# Altium schematic sheet Inputs.SchDoc
size A4
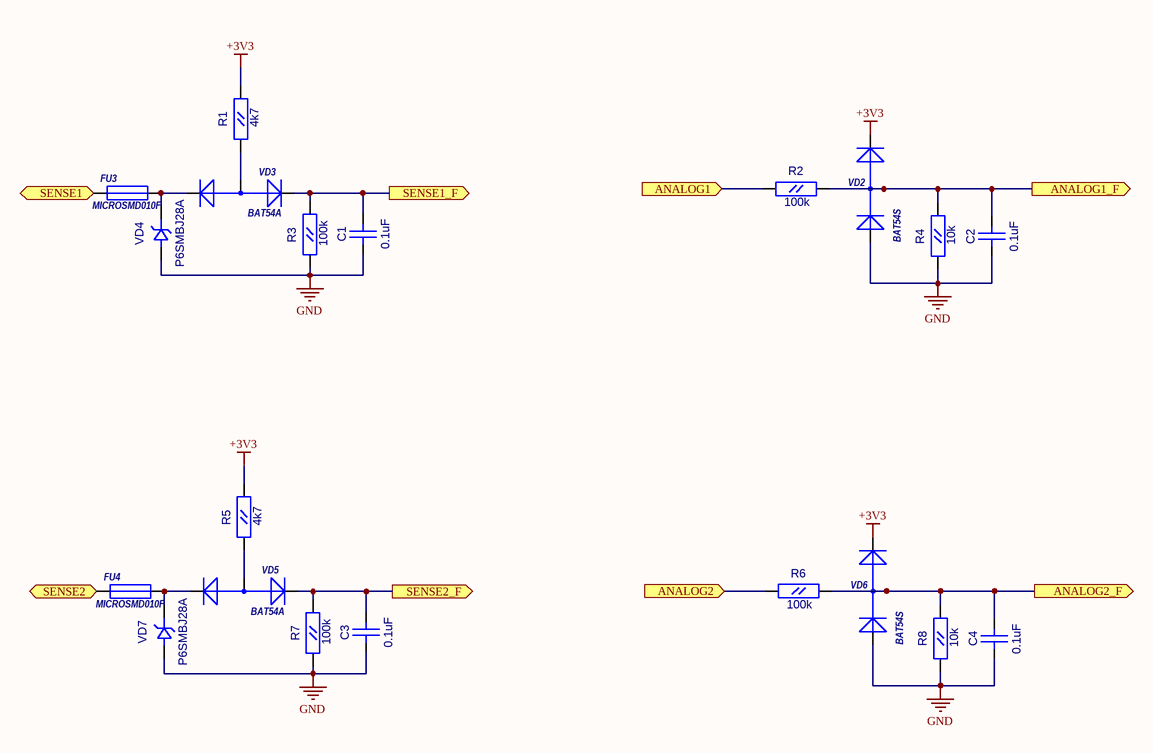
[diagram p0: Inputs.SchDoc]

## Parts
C1  0.1uF  [CC0603]
C2  0.1uF  [CC0603]
C3  0.1uF  [CC0603]
C4  0.1uF  [CC0603]
FU3  MICROSMD010F  [RC1210]
FU4  MICROSMD010F  [RC1210]
R1  4k7  [RC0603]
R2  100k  [RC0603]
R3  100k  [RC0603]
R4  10k  [RC0603]
R5  4k7  [RC0603]
R6  100k  [RC0603]
R7  100k  [RC0603]
R8  10k  [RC0603]
VD2  BAT54S  [SOT-23(GSD)]
VD3  BAT54A  [SOT-23(123)]
VD4  P6SMBJ28A  [SMB]
VD5  BAT54A  [SOT-23(123)]
VD6  BAT54S  [SOT-23(GSD)]
VD7  P6SMBJ28A  [SMB]

## Ports
ANALOG1 (in), ANALOG1_F (out), ANALOG2 (in), ANALOG2_F (out), SENSE1 (in), SENSE1_F (out), SENSE2 (in), SENSE2_F (out)

## Nets
+3V3: R1.2(B) R5.2(B) VD2.2(K) VD6.2(K)
GND: C1.1(A) C2.1(A) C3.1(A) C4.1(A) R3.1(A) R4.1(A) R7.1(A) R8.1(A) VD2.1(A) VD4.1(A) VD6.1(A) VD7.1(A)
ANALOG1: R2.1(A) ; port ANALOG1
ANALOG1_F: C2.2(B) R2.2(B) R4.2(B) VD2.3(AK) ; port ANALOG1_F
ANALOG2: R6.1(A) ; port ANALOG2
ANALOG2_F: C4.2(B) R6.2(B) R8.2(B) VD6.3(AK) ; port ANALOG2_F
SENSE1: FU3.1 ; port SENSE1
SENSE1_F: C1.2(B) R3.2(B) VD3.1(K) ; port SENSE1_F
SENSE2: FU4.1 ; port SENSE2
SENSE2_F: C3.2(B) R7.2(B) VD5.1(K) ; port SENSE2_F
NetFU3_2: FU3.2 VD3.2(K) VD4.2(K)
NetFU4_2: FU4.2 VD5.2(K) VD7.2(K)
NetR1_1: R1.1(A) VD3.3(A)
NetR5_1: R5.1(A) VD5.3(A)

## Library data of the parts
C1-C4 = CC0603: Value: 0.1uF
FU3 FU4 = MICROSMD: Value: MICROSMD010F
R1-R8 = RC0603
  R1 R5: Value: 4k7
  R2 R3 R6 R7: Value: 100k
  R4 R8: Value: 10k
VD2 VD6 = BAT54S: 1.0 Ampere General Purpose Rectifier; ComponentField6: Published 8-Jun-2000, Modified 11-July-2000: SIM Model Added.; Value: *
VD3 VD5 = BAT54A: 1.0 Ampere General Purpose Rectifier; ComponentField6: Published 8-Jun-2000, Modified 11-July-2000: SIM Model Added.; Value: *
VD4 VD7 = SMBJ: Value: P6SMBJ28A